# EAGLE design backplate_final_rev02 (EAGLE 9.6.0)
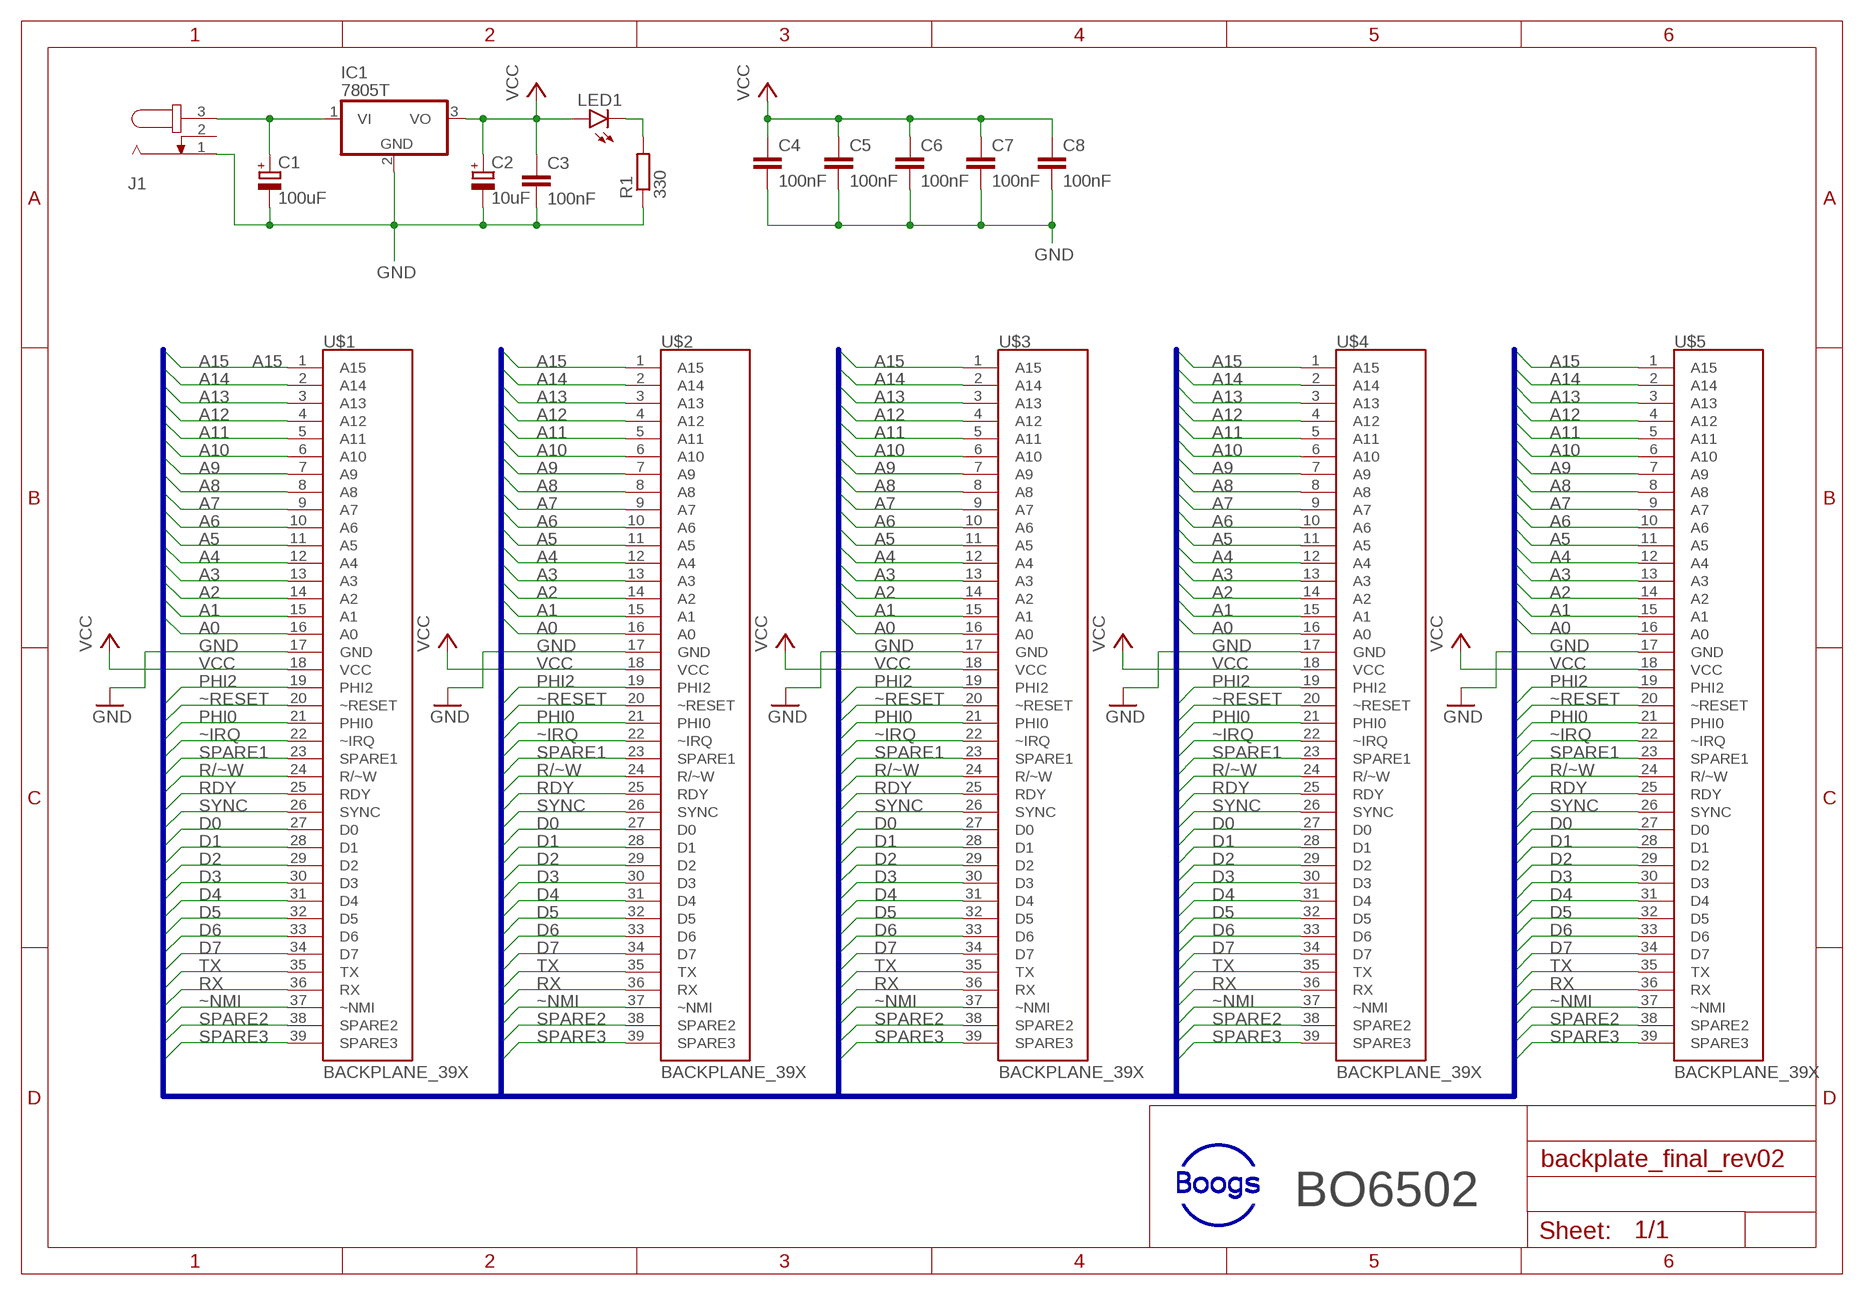
[diagram p0: schematic, sheet 1]

## Parts
C1  100uF  CPOL-EUB45181A  [B45181A]
C2  10uF  CPOL-EUB45181A  [B45181A]
C3  100nF  C-EU025-025X050  [C025-025X050]
C4  100nF  C-EU025-025X050  [C025-025X050]
C5  100nF  C-EU025-025X050  [C025-025X050]
C6  100nF  C-EU025-025X050  [C025-025X050]
C7  100nF  C-EU025-025X050  [C025-025X050]
C8  100nF  C-EU025-025X050  [C025-025X050]
IC1  7805T  [TO220H]
J1  JACK-PLUG1  [SPC4078]
LED1  LED5MM  [LED5MM]
R1  330  R-EU_0207/10  [0207/10]
U$1  BACKPLANE_39X  [BP_39X]
U$2  BACKPLANE_39X  [BP_39X]
U$3  BACKPLANE_39X  [BP_39X]
U$4  BACKPLANE_39X  [BP_39X]
U$5  BACKPLANE_39X  [BP_39X]

## Nets
A0: U$1.16(A0) U$2.16(A0) U$3.16(A0) U$4.16(A0) U$5.16(A0)
A1: U$1.15(A1) U$2.15(A1) U$3.15(A1) U$4.15(A1) U$5.15(A1)
A2: U$1.14(A2) U$2.14(A2) U$3.14(A2) U$4.14(A2) U$5.14(A2)
A3: U$1.13(A3) U$2.13(A3) U$3.13(A3) U$4.13(A3) U$5.13(A3)
A4: U$1.12(A4) U$2.12(A4) U$3.12(A4) U$4.12(A4) U$5.12(A4)
A5: U$1.11(A5) U$2.11(A5) U$3.11(A5) U$4.11(A5) U$5.11(A5)
A6: U$1.10(A6) U$2.10(A6) U$3.10(A6) U$4.10(A6) U$5.10(A6)
A7: U$1.9(A7) U$2.9(A7) U$3.9(A7) U$4.9(A7) U$5.9(A7)
A8: U$1.8(A8) U$2.8(A8) U$3.8(A8) U$4.8(A8) U$5.8(A8)
A9: U$1.7(A9) U$2.7(A9) U$3.7(A9) U$4.7(A9) U$5.7(A9)
A10: U$1.6(A10) U$2.6(A10) U$3.6(A10) U$4.6(A10) U$5.6(A10)
A11: U$1.5(A11) U$2.5(A11) U$3.5(A11) U$4.5(A11) U$5.5(A11)
A12: U$1.4(A12) U$2.4(A12) U$3.4(A12) U$4.4(A12) U$5.4(A12)
A13: U$1.3(A13) U$2.3(A13) U$3.3(A13) U$4.3(A13) U$5.3(A13)
A14: U$1.2(A14) U$2.2(A14) U$3.2(A14) U$4.2(A14) U$5.2(A14)
A15: U$1.1(A15) U$2.1(A15) U$3.1(A15) U$4.1(A15) U$5.1(A15)
D0: U$1.27(D0) U$2.27(D0) U$3.27(D0) U$4.27(D0) U$5.27(D0)
D1: U$1.28(D1) U$2.28(D1) U$3.28(D1) U$4.28(D1) U$5.28(D1)
D2: U$1.29(D2) U$2.29(D2) U$3.29(D2) U$4.29(D2) U$5.29(D2)
D3: U$1.30(D3) U$2.30(D3) U$3.30(D3) U$4.30(D3) U$5.30(D3)
D4: U$1.31(D4) U$2.31(D4) U$3.31(D4) U$4.31(D4) U$5.31(D4)
D5: U$1.32(D5) U$2.32(D5) U$3.32(D5) U$4.32(D5) U$5.32(D5)
D6: U$1.33(D6) U$2.33(D6) U$3.33(D6) U$4.33(D6) U$5.33(D6)
D7: U$1.34(D7) U$2.34(D7) U$3.34(D7) U$4.34(D7) U$5.34(D7)
GND: C1.- C2.- C3.2 C4.2 C5.2 C6.2 C7.2 C8.2 IC1.2(GND) J1.1 R1.1 U$1.17(GND) U$2.17(GND) U$3.17(GND) U$4.17(GND) U$5.17(GND)
N$1: C1.+ IC1.1(VI) J1.3
N$4: LED1.K(C) R1.2
PHI0: U$1.21(PHI0) U$2.21(PHI0) U$3.21(PHI0) U$4.21(PHI0) U$5.21(PHI0)
PHI2: U$1.19(PHI2) U$2.19(PHI2) U$3.19(PHI2) U$4.19(PHI2) U$5.19(PHI2)
R/~W: U$1.24(R/~W) U$2.24(R/~W) U$3.24(R/~W) U$4.24(R/~W) U$5.24(R/~W)
RDY: U$1.25(RDY) U$2.25(RDY) U$3.25(RDY) U$4.25(RDY) U$5.25(RDY)
RX: U$1.36(RX) U$2.36(RX) U$3.36(RX) U$4.36(RX) U$5.36(RX)
SPARE1: U$1.23(SPARE1) U$2.23(SPARE1) U$3.23(SPARE1) U$4.23(SPARE1) U$5.23(SPARE1)
SPARE2: U$1.38(SPARE2) U$2.38(SPARE2) U$3.38(SPARE2) U$4.38(SPARE2) U$5.38(SPARE2)
SPARE3: U$1.39(SPARE3) U$2.39(SPARE3) U$3.39(SPARE3) U$4.39(SPARE3) U$5.39(SPARE3)
SYNC: U$1.26(SYNC) U$2.26(SYNC) U$3.26(SYNC) U$4.26(SYNC) U$5.26(SYNC)
TX: U$1.35(TX) U$2.35(TX) U$3.35(TX) U$4.35(TX) U$5.35(TX)
VCC: C2.+ C3.1 C4.1 C5.1 C6.1 C7.1 C8.1 IC1.3(VO) LED1.A U$1.18(VCC) U$2.18(VCC) U$3.18(VCC) U$4.18(VCC) U$5.18(VCC)
~IRQ: U$1.22(~IRQ) U$2.22(~IRQ) U$3.22(~IRQ) U$4.22(~IRQ) U$5.22(~IRQ)
~NMI: U$1.37(~NMI) U$2.37(~NMI) U$3.37(~NMI) U$4.37(~NMI) U$5.37(~NMI)
~RESET: U$1.20(~RESET) U$2.20(~RESET) U$3.20(~RESET) U$4.20(~RESET) U$5.20(~RESET)
Unconnected: J1.2

## Buses
A0,A1,A2,A3,A4,A5,A6,A7,A8,A9,A10,A11,A12,A13,A14,A15,D0,D1,D2,D3,D4,D5,D6,D7,~IRQ,~NMI,PHI0,PHI2,RDY,~RESET,R/~W,RX,SPARE1,SPARE2,SPARE3,SYNC,TX

## Notes on the sheet
- BO6502

## Library data of the parts
C1 C2 = rcl:CPOL-EU: POLARIZED CAPACITOR, European symbol; SPICEPREFIX: C
C3-C8 = rcl:C-EU: CAPACITOR, European symbol; SPICEPREFIX: C
IC1 = linear:78*: Positive VOLTAGE REGULATOR Source: http://cache.national.com/ds/LM/LM78L05.pdf http://www.fairchildsemi.com/ds/LM/LM7805.pdf
J1 = con-jack:JACK-PLUG: DC POWER JACK Power Jack, DC, Right Angle, Through Hole, Rated 5A at 16VDC, PC Terminals Distributor: Farnell (www.Farnell.de) Drawing: 84N1161.pdf / 84N1162.pdf Manufacturer: SPC Technology (www.spctechnology.com) Type: SPC4077 / SPC 4078; OC_FARNELL: unknown; OC_NEWARK: unknown
LED1 = led:LED: LED OSRAM: - CHIPLED LG R971, LG N971, LY N971, LG Q971, LY Q971, LO R971, LY R971 LH N974, LH R974 LS Q976, LO Q976, LY Q976 LO Q996 - Hyper CHIPLED LW Q18S LB Q993, LB Q99A, LB R99A - SideLED LS A670, LO A670, LY A670, LG A670, LP A670 LB A673, LV A673, LT A673, LW A673 LH A674 LY A675 LS A676, LA A676, LO A676, LY A676, LW A676 LS A679, LY A679, LG A679 - Hyper Micro SIDELED® LS Y876, LA Y876, LO Y876, LY Y876 LT Y87S - SmartLED LW L88C, LW L88S LB L89C, LB L89S, LG L890 LS L89K, LO L89K, LY L89K LS L896, LA L896, LO L896, LY L896 - TOPLED LS T670, LO T670, LY T670, LG T670, LP T670 LSG T670, LSP T670, LSY T670, LOP T670, LYG T670 LG T671, LOG T671, LSG T671 LB T673, LV T673, LT T673, LW T673 LH T674 LS T676, LA T676, LO T676, LY T676, LB T676, LH T676, LSB T676, LW T676 LB T67C, LV T67C, LT T67C, LS T67K, LO T67K, LY T67K, LW E67C LS E67B, LA E67B, LO E67B, LY E67B, LB E67C, LV E67C, LT E67C LW T67C LS T679, LY T679, LG T679 LS T770, LO T770, LY T770, LG T770, LP T770 LB T773, LV T773, LT T773, LW T773 LH T774 LS E675, LA E675, LY E675, LS T675 LS T776, LA T776, LO T776, LY T776, LB T776 LHGB T686 LT T68C, LB T68C - Hyper Mini TOPLED® LB M676 - Mini TOPLED Santana® LG M470 LS M47K, LO M47K, LY M47K Source: http://www.osram.convergy.de LUXEON: - LUMILED® LXK2-PW12-R00, LXK2-PW12-S00, LXK2-PW14-U00, LXK2-PW14-V00 LXK2-PM12-R00, LXK2-PM12-S00, LXK2-PM14-U00 LXK2-PE12-Q00, LXK2-PE12-R00, LXK2-PE12-S00, LXK2-PE14-T00, LXK2-PE14-U00 LXK2-PB12-K00, LXK2-PB12-L00, LXK2-PB12-M00, LXK2-PB14-N00, LXK2-PB14-P00, LXK2-PB14-Q00 LXK2-PR12-L00, LXK2-PR12-M00, LXK2-PR14-Q00, LXK2-PR14-R00 LXK2-PD12-Q00, LXK2-PD12-R00, LXK2-PD12-S00 LXK2-PH12-R00, LXK2-PH12-S00 LXK2-PL12-P00, LXK2-PL12-Q00, LXK2-PL12-R00 Source: www.luxeon.com KINGBRIGHT: KA-3528ASYC Source: www.kingbright.com
R1 = rcl:R-EU_: RESISTOR, European symbol; SPICEPREFIX: R
U$1 = 65xx_family:BACKPLANE_39X; A15: A15
U$2-U$5 = 65xx_family:BACKPLANE_39X

## Board
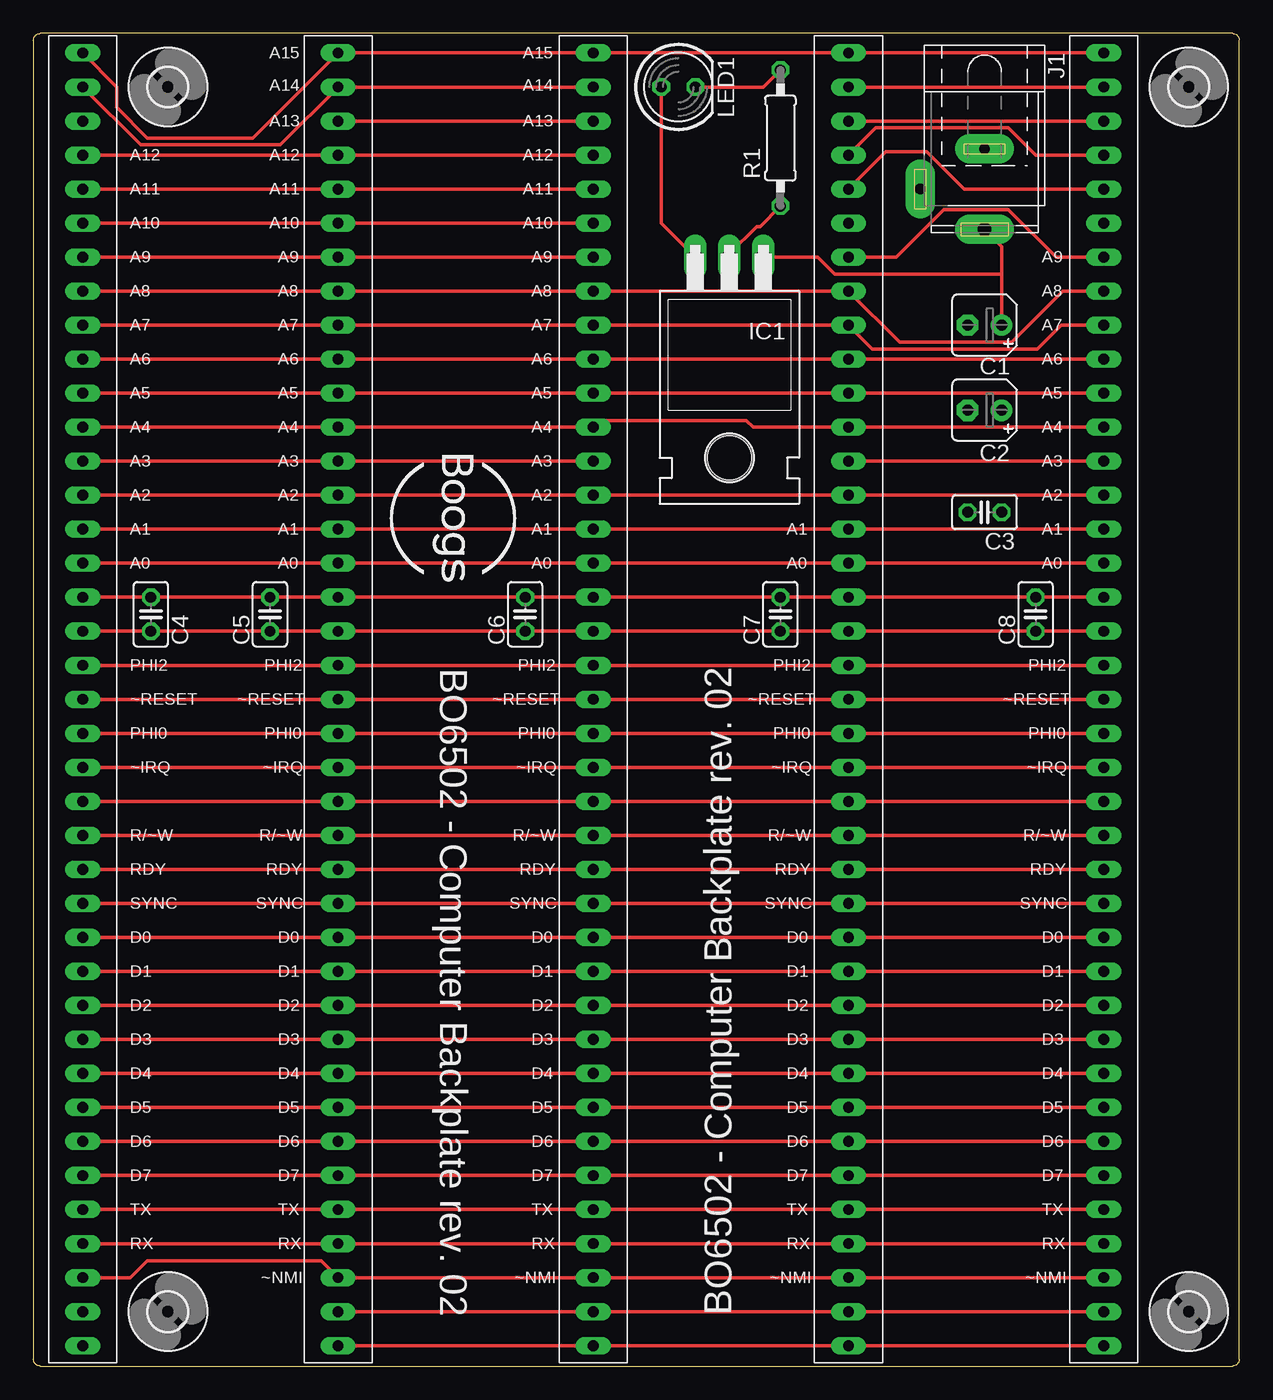
[diagram p1: board, top side]
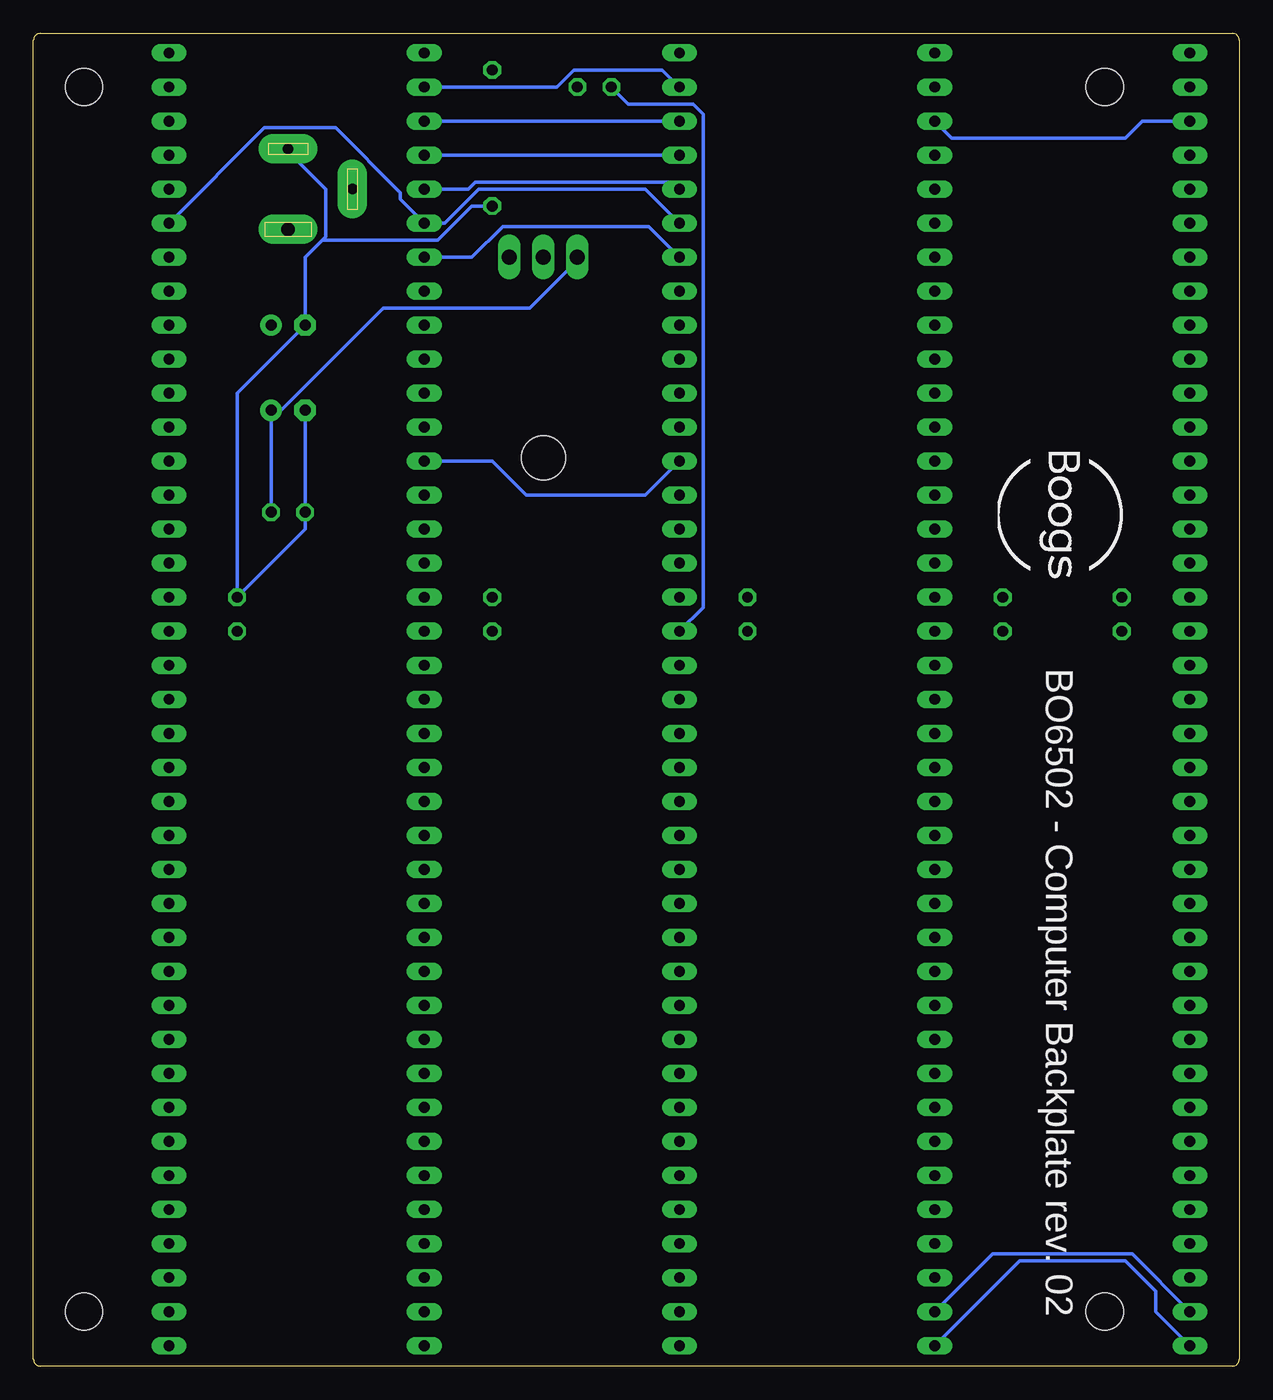
[diagram p2: board, bottom side, seen from below]

Size 90 x 99.5 mm. Coordinates in mm from the lower left corner, seen from the top.
Outline: 0.5,0 89.5,0 arc90 90,0.5 90,99 arc90 89.5,99.5 0.5,99.5 arc90 0,99 0,0.5 arc90 0.5,0
Copper layers (1*16): Top 0.035mm / dielectric 1.5mm / Bottom 0.035mm
Design rules "default *": minimum track width 10mil, minimum drill 0.35mm, track to track 10mil, track to pad 10mil, pad to pad 10mil, via to via 10mil, smd to smd 6mil, copper to edge 40mil, drill to drill 6mil, minimum pad ring 10mil, minimum via ring 8mil, stop-mask expansion 4mil, vias tented up to drill 0mil, thermal gap 10mil

### Footprints (pad centres in the part's own frame; a part is rotated, then mirrored left to right if it is on the bottom)
B45181A = drill 0.813 pad 1.6: + -1.27,0 | drill 0.813 pad 1.6 octagon: - 1.27,0
C025-025X050 = drill 0.813 octagon: 1 -1.27,0; 2 1.27,0
TO220H = drill 1.118 long: 1 -2.54,-10.16; 2 0,-10.16; 3 2.54,-10.16 | hole 3.302: 0,4.826
SPC4078 = drill 0.8 pad 2.184 long: 1 -3,0; 2 0,-4.8 | drill 1 pad 2.184 long: 3 3,0
LED5MM = drill 0.813 octagon: A -1.27,0; K 1.27,0
0207/10 = drill 0.813 octagon: 1 -5.08,0; 2 5.08,0
BP_39X = drill 0.813 long: 1 1.27,59.69; 2 1.27,57.15; 3 1.27,54.61; 4 1.27,52.07; 5 1.27,49.53; 6 1.27,46.99; 7 1.27,44.45; 8 1.27,41.91; 9 1.27,39.37; 10 1.27,36.83; 11 1.27,34.29; 12 1.27,31.75; 13 1.27,29.21; 14 1.27,26.67; 15 1.27,24.13; 16 1.27,21.59; 17 1.27,19.05; 18 1.27,16.51; 19 1.27,13.97; 20 1.27,11.43; 21 1.27,8.89; 22 1.27,6.35; 23 1.27,3.81; 24 1.27,1.27; 25 1.27,-1.27; 26 1.27,-3.81; 27 1.27,-6.35; 28 1.27,-8.89; 29 1.27,-11.43; 30 1.27,-13.97; 31 1.27,-16.51; 32 1.27,-19.05; 33 1.27,-21.59; 34 1.27,-24.13; 35 1.27,-26.67; 36 1.27,-29.21; 37 1.27,-31.75; 38 1.27,-34.29; 39 1.27,-36.83
2,8 = hole 2.8: 0,0

### Placement (x,y rotation side)
C1  70.99,77.72 180 top
C2  70.99,71.37 180 top
C3  70.99,63.75 180 top
C4  8.76,56.13 90 top
C5  17.65,56.13 90 top
C6  36.7,56.13 90 top
C7  55.75,56.13 90 top
C8  74.8,56.13 90 top
IC1  51.94,72.64 180 top
J1  70.99,87.88 270 top
LED1  48.13,95.5 0 top
R1  55.75,91.69 90 top
U$1  2.41,38.35 0 top
U$2  21.46,38.35 0 top
U$3  40.51,38.35 0 top
U$4  59.56,38.35 0 top
U$5  78.61,38.35 0 top
U$7  [2,8]  10.03,95.5 0 top
U$8  [2,8]  10.03,4.06 0 top
U$9  [2,8]  86.23,4.06 0 top
U$10  [2,8]  86.23,95.5 0 top

### Tracks (layer width: path | path; a pad name or v marks a point on that pad's centre or on a via)
A0
  Top 0.254: U$1.16 U$2.16 U$3.16 U$4.16 U$5.16
A1
  Top 0.254: U$1.15 U$2.15 U$3.15 U$4.15 U$5.15
A2
  Top 0.254: U$1.14 U$2.14 U$3.14 U$4.14 U$5.14
A3
  Top 0.254: U$5.13 U$4.13 | U$1.13 U$2.13 U$3.13
  Bottom 0.254: U$4.13 55.75,67.56 53.21,65.02 44.32,65.02 U$3.13
A4
  Top 0.254: U$5.12 U$4.12 53.72,70.1 53.21,70.61 42.29,70.61 U$3.12 U$2.12 U$1.12
A5
  Top 0.254: U$1.11 U$2.11 U$3.11 U$4.11 U$5.11
A6
  Top 0.254: U$1.10 U$2.10 U$3.10 U$4.10 U$5.10
A7
  Top 0.254: U$1.9 U$2.9 U$3.9 U$4.9 62.61,75.95 74.93,75.95 76.71,77.72 U$5.9
A8
  Top 0.254: U$1.8 U$2.8 U$3.8 U$4.8 64.64,76.45 73.03,76.45 76.83,80.26 U$5.8
A9
  Top 0.254: U$1.7 U$2.7 U$3.7 | U$5.7 76.33,82.8 72.77,86.36 67.94,86.36 64.39,82.8 U$4.7
  Bottom 0.254: U$4.7 57.28,82.8 54.99,85.09 44.07,85.09 U$3.7
A10
  Top 0.254: U$1.6 U$2.6 U$3.6
  Bottom 0.254: U$3.6 44.32,87.88 56.77,87.88 59.31,85.34 U$4.6 62.61,87.12 62.61,87.63 67.44,92.46 72.77,92.46 U$5.6
A11
  Top 0.254: U$1.5 U$2.5 U$3.5 | U$5.5 69.47,87.88 66.67,90.68 63.63,90.68 U$4.5
  Bottom 0.254: U$4.5 57.53,87.88 57.02,88.39 42.29,88.39 U$3.5
A12
  Top 0.254: U$1.4 U$2.4 U$3.4 | U$5.4 74.8,90.42 72.77,92.46 62.87,92.46 U$4.4
  Bottom 0.254: U$3.4 U$4.4
A13
  Top 0.254: U$5.3 U$4.3 | U$2.3 U$3.3
  Bottom 0.254: U$1.3 7.24,92.96 8.51,91.69 21.46,91.69 U$2.3 | U$3.3 U$4.3
A14
  Top 0.254: U$5.2 U$4.2 | U$1.2 8,91.19 18.41,91.19 U$2.2 U$3.2
  Bottom 0.254: U$4.2 50.93,95.5 49.66,96.77 43.05,96.77 U$3.2
A15
  Top 0.254: U$1.1 6.22,95.5 6.22,93.98 8.51,91.69 16.38,91.69 U$2.1 U$3.1 U$4.1 U$5.1
D0
  Top 0.254: U$1.27 U$2.27 U$3.27 U$4.27 U$5.27
D1
  Top 0.254: U$1.28 U$2.28 U$3.28 U$4.28 U$5.28
D2
  Top 0.254: U$1.29 U$2.29 U$3.29 U$4.29 U$5.29
D3
  Top 0.254: U$1.30 U$2.30 U$3.30 U$4.30 U$5.30
D4
  Top 0.254: U$1.31 U$2.31 U$3.31 U$4.31 U$5.31
D5
  Top 0.254: U$1.32 U$2.32 U$3.32 U$4.32 U$5.32
D6
  Top 0.254: U$1.33 U$2.33 U$3.33 U$4.33 U$5.33
D7
  Top 0.254: U$1.34 U$2.34 U$3.34 U$4.34 U$5.34
GND
  Top 0.254: R1.1 54.23,85.09 53.98,85.09 51.94,83.06 IC1.2 | U$5.17 C8.2 U$4.17 C7.2 U$3.17 C6.2 U$2.17 C5.2 C4.2 U$1.17
  Bottom 0.254: C2.- C3.2 69.72,62.48 C8.2 74.8,72.64 C1.- 69.72,82.8 68.45,84.07 | 68.45,84.07 68.2,84.33 68.2,87.88 70.99,90.68 J1.1 | R1.1 57.28,86.61 59.82,84.07 68.45,84.07
N$1
  Top 0.254: 72.26,81.53 72.26,83.57 70.99,84.84 J1.3 | 72.26,81.53 C1.+ | IC1.1 58.55,82.8 59.82,81.53 72.26,81.53
N$4
  Top 0.254: LED1.K 54.48,95.5 R1.2
PHI0
  Top 0.254: U$1.21 U$2.21 U$3.21 U$4.21 U$5.21
PHI2
  Top 0.254: U$1.19 U$2.19 U$3.19 U$4.19 U$5.19
R/~W
  Top 0.254: U$1.24 U$2.24 U$3.24 U$4.24 U$5.24
RDY
  Top 0.254: U$1.25 U$2.25 U$3.25 U$4.25 U$5.25
RX
  Top 0.254: U$1.36 U$2.36 U$3.36 U$4.36 U$5.36
SPARE1
  Top 0.254: U$1.23 U$2.23 U$3.23 U$4.23 U$5.23
SPARE2
  Top 0.254: U$2.38 U$3.38 U$4.38 U$5.38
  Bottom 0.254: U$1.38 8,8.38 18.41,8.38 U$2.38
SPARE3
  Top 0.254: U$2.39 U$3.39 U$4.39 U$5.39
  Bottom 0.254: U$1.39 6.22,4.06 6.22,5.59 8.51,7.87 16.38,7.87 U$2.39
SYNC
  Top 0.254: U$1.26 U$2.26 U$3.26 U$4.26 U$5.26
TX
  Top 0.254: U$1.35 U$2.35 U$3.35 U$4.35 U$5.35
VCC
  Top 0.254: U$5.18 C8.1 U$4.18 C7.1 U$3.18 C6.1 U$2.18 C5.1 C4.1 U$1.18 | LED1.A 46.86,85.34 IC1.3
  Bottom 0.254: LED1.A 45.59,94.23 40.77,94.23 40.01,93.47 40.01,56.64 U$3.18 | C3.1 C2.+ 71.5,71.37 63.88,78.99 52.96,78.99 49.4,82.55 IC1.3
~IRQ
  Top 0.254: U$1.22 U$2.22 U$3.22 U$4.22 U$5.22
~NMI
  Top 0.254: U$1.37 7.24,6.6 8.51,7.87 21.46,7.87 U$2.37 U$3.37 U$4.37 U$5.37
~RESET
  Top 0.254: U$1.20 U$2.20 U$3.20 U$4.20 U$5.20

### Text on the board
tNames: A15 | A15 | A14 | A14 | A13 | A13 | A12 | A12 | A12 | A11 | A11 | A11 | A10 | A10 | A10 | A9 | A9 | A9 | A9 | A8 | A8 | A8 | A8 | A7 | A7 | A7 | A7 | A6 | A6 | A6 | A6 | A5 | A5 | A5 | A5 | A4 | A4 | A4 | A4 | A3 | A3 | A3 | A3 | A2 | A2 | A2 | A2 | A1 | A1 | A1 | A1 | A1 | A0 | A0 | A0 | A0 | A0 | PHI2 | PHI2 | BO6502 - Computer Backplate rev. 02 | PHI2 | BO6502 - Computer Backplate rev. 02 | PHI2 | PHI2 | ~RESET | ~RESET | ~RESET | ~RESET | ~RESET | PHI0 | PHI0 | PHI0 | PHI0 | PHI0 | ~IRQ | ~IRQ | ~IRQ | ~IRQ | ~IRQ | R/~W | R/~W | R/~W | R/~W | R/~W | RDY | RDY | RDY | RDY | RDY | SYNC | SYNC | SYNC | SYNC | SYNC | D0 | D0 | D0 | D0 | D0 | D1 | D1 | D1 | D1 | D1 | D2 | D2 | D2 | D2 | D2 | D3 | D3 | D3 | D3 | D3 | D4 | D4 | D4 | D4 | D4 | D5 | D5 | D5 | D5 | D5 | D6 | D6 | D6 | D6 | D6 | D7 | D7 | D7 | D7 | D7 | TX | TX | TX | TX | TX | RX | RX | RX | RX | RX | ~NMI | ~NMI | ~NMI | ~NMI
bNames: BO6502 - Computer Backplate rev. 02